# Altium schematic sheet Power Supply.schdoc
size 292 x 119 mm; SheetNumber: 1; SheetTotal: 1
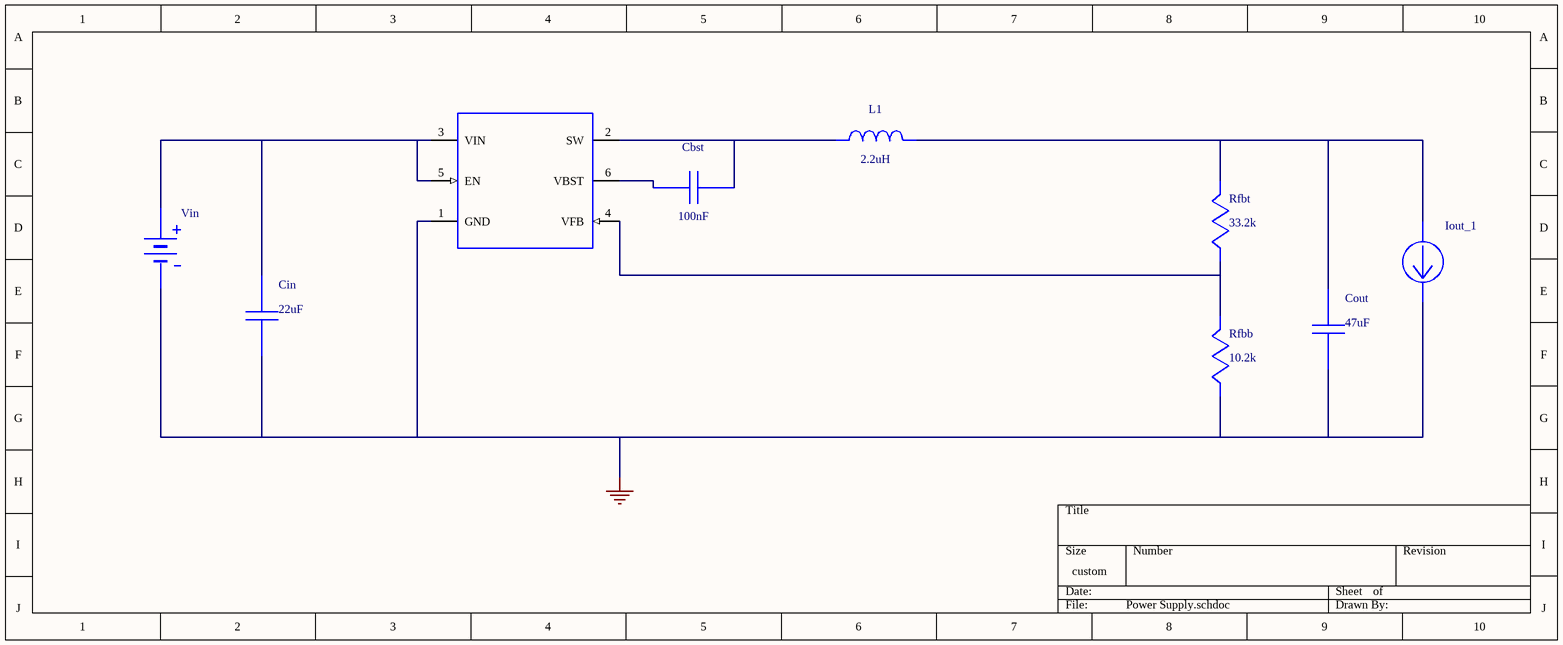
[diagram p0: Power Supply.schdoc]

## Parts
Cbst  value 100nF  (hidden comment: 08053C104KAT2A)
Cin  value 22uF  (hidden comment: GRM32ER61E226KE15L)
Cout  value 47uF  (hidden comment: C3216X5R1E476M160AC)
Iout_1  WB_CURRENT_LOAD  (value not drawn)
L1  value 2.2uH  (hidden comment: SRN8040-2R2Y)
Rfbb  value 10.2k  (hidden comment: CRCW040210K2FKED)
Rfbt  value 33.2k  (hidden comment: CRCW040233K2FKED)
U1  TPS563200DDCR  (value not drawn)
Vin  WB_BATTERY  (value not drawn)

## Nets
0: Cin.2 Cout.2 Iout_1.2(-) Rfbb.2 U1.1(GND) Vin.2(-)
NetCbst_1: Cbst.1 L1.1 U1.2(SW)
NetCbst_2: Cbst.2 U1.6(VBST)
NetCin_1: Cin.1 U1.3(VIN) U1.5(EN) Vin.1(+)
NetCout_1: Cout.1 Iout_1.1(+) L1.2 Rfbt.1
NetRfbb_1: Rfbb.1 Rfbt.2 U1.4(VFB)

## Library data of the parts
Cbst = 08053C104KAT2A: Manufacturer Name: AVX; PackageReference: 08053C104KAT2A; Manufacturer Part Number: 08053C104KAT2A
Cin = GRM32ER61E226KE15L: GRM32ER61E226KE1; Manufacturer Name: MuRata; PackageReference: GRM32ER61E226KE15L; Manufacturer Part Number: GRM32ER61E226KE15L
Cout = C3216X5R1E476M160AC: C3216X5R1E476M16; Manufacturer Name: TDK; PackageReference: C3216X5R1E476M160AC; Manufacturer Part Number: C3216X5R1E476M160AC
L1 = SRN8040-2R2Y: Manufacturer Name: Bourns; PackageReference: SRN8040-2R2Y; Manufacturer Part Number: SRN8040-2R2Y
Rfbb = CRCW040210K2FKED: Manufacturer Name: Vishay-Dale; PackageReference: CRCW040210K2FKED; Manufacturer Part Number: CRCW040210K2FKED
Rfbt = CRCW040233K2FKED: Manufacturer Name: Vishay-Dale; PackageReference: CRCW040233K2FKED; Manufacturer Part Number: CRCW040233K2FKED
U1 = TPS563200DDCR: Manufacturer Name: Texas Instruments; PackageReference: Type; Manufacturer Part Number: TPS563200DDCR; Value: Value
Iout_1 = WB_CURRENT_LOAD: PackageReference: WB_CURRENT_LOAD; Manufacturer Part Number: WB_CURRENT_LOAD; Manufacturer Name: WB_CURRENT_LOAD; Value: N/A
Vin = WB_BATTERY: PackageReference: WB_BATTERY; Manufacturer Part Number: WB_BATTERY; Manufacturer Name: WB_BATTERY; Value: N/A